# Altium schematic sheet voltage_sensor_HiZ_LV_OpAmp.SchDoc
size A4
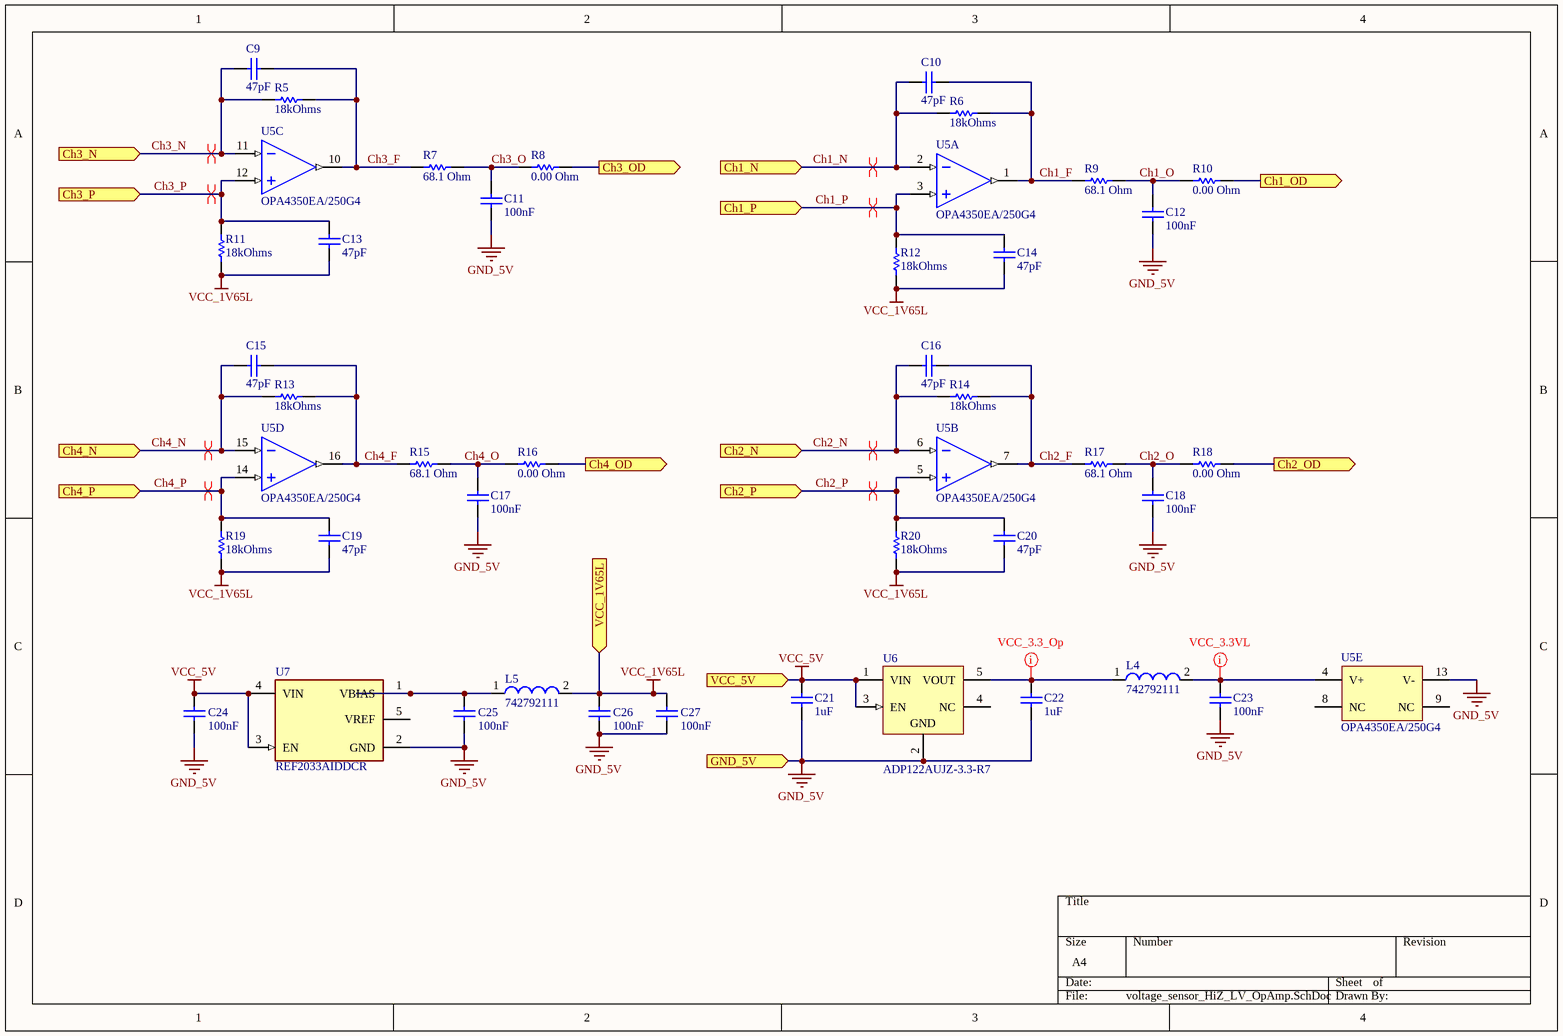
[diagram p0: voltage_sensor_HiZ_LV_OpAmp.SchDoc]

## Parts
C9  value 47pF  [CAPC0603(1608)100_L]  (hidden comment: CAP 47pF 50V 0603(1608))
C10  value 47pF  [CAPC0603(1608)100_L]  (hidden comment: CAP 47pF 50V 0603(1608))
C11  value 100nF  [CAPC0603(1608)100_L]  (hidden comment: CAP 100nF 10V 0603(1608))
C12  value 100nF  [CAPC0603(1608)100_L]  (hidden comment: CAP 100nF 10V 0603(1608))
C13  value 47pF  [CAPC0603(1608)100_L]  (hidden comment: CAP 47pF 50V 0603(1608))
C14  value 47pF  [CAPC0603(1608)100_L]  (hidden comment: CAP 47pF 50V 0603(1608))
C15  value 47pF  [CAPC0603(1608)100_L]  (hidden comment: CAP 47pF 50V 0603(1608))
C16  value 47pF  [CAPC0603(1608)100_L]  (hidden comment: CAP 47pF 50V 0603(1608))
C17  value 100nF  [CAPC0603(1608)100_L]  (hidden comment: CAP 100nF 10V 0603(1608))
C18  value 100nF  [CAPC0603(1608)100_L]  (hidden comment: CAP 100nF 10V 0603(1608))
C19  value 47pF  [CAPC0603(1608)100_L]  (hidden comment: CAP 47pF 50V 0603(1608))
C20  value 47pF  [CAPC0603(1608)100_L]  (hidden comment: CAP 47pF 50V 0603(1608))
C21  value 1uF  [CAPC0603(1608)100_N]  (hidden comment: CAP 1uF 50V 0603(1608))
C22  value 1uF  [CAPC0603(1608)100_N]  (hidden comment: CAP 1uF 50V 0603(1608))
C23  value 100nF  [CAPC0603(1608)100_L]  (hidden comment: CAP 100nF 10V 0603(1608))
C24  value 100nF  [CAPC0603(1608)100_N]  (hidden comment: CAP 100nF 10V 0603(1608))
C25  value 100nF  [CAPC0603(1608)100_N]  (hidden comment: CAP 100nF 10V 0603(1608))
C26  value 100nF  [CAPC0603(1608)100_L]  (hidden comment: CAP 100nF 10V 0603(1608))
C27  value 100nF  [CAPC0603(1608)100_L]  (hidden comment: CAP 100nF 10V 0603(1608))
L4  742792111  [SMD-1206]
L5  742792111  [SMD-1206]
R5  Resistance: 18kOhms  [RESC1608X55X25LL10T15]  (hidden comment: RC0603FR-0718KL)
R6  Resistance: 18kOhms  [RESC1608X55X25LL10T15]  (hidden comment: RC0603FR-0718KL)
R7  value 68.1 Ohm  [RESC1608X55X30LL15T15]  (hidden comment: ERJ-3EKF68R1V)
R8  value 0.00 Ohm  [RESC0603(1608)_L]  (hidden comment: Jumper 0603(1608))
R9  value 68.1 Ohm  [RESC1608X55X30LL15T15]  (hidden comment: ERJ-3EKF68R1V)
R10  value 0.00 Ohm  [RESC0603(1608)_L]  (hidden comment: Jumper 0603(1608))
R11  Resistance: 18kOhms  [RESC1608X55X25LL10T15]  (hidden comment: RC0603FR-0718KL)
R12  Resistance: 18kOhms  [RESC1608X55X25LL10T15]  (hidden comment: RC0603FR-0718KL)
R13  Resistance: 18kOhms  [RESC1608X55X25LL10T15]  (hidden comment: RC0603FR-0718KL)
R14  Resistance: 18kOhms  [RESC1608X55X25LL10T15]  (hidden comment: RC0603FR-0718KL)
R15  value 68.1 Ohm  [RESC1608X55X30LL15T15]  (hidden comment: ERJ-3EKF68R1V)
R16  value 0.00 Ohm  [RESC0603(1608)_L]  (hidden comment: Jumper 0603(1608))
R17  value 68.1 Ohm  [RESC1608X55X30LL15T15]  (hidden comment: ERJ-3EKF68R1V)
R18  value 0.00 Ohm  [RESC0603(1608)_L]  (hidden comment: Jumper 0603(1608))
R19  Resistance: 18kOhms  [RESC1608X55X25LL10T15]  (hidden comment: RC0603FR-0718KL)
R20  Resistance: 18kOhms  [RESC1608X55X25LL10T15]  (hidden comment: RC0603FR-0718KL)
U5  OPA4350EA/250G4  [TI-DBQ16_L]  (parts A,B,C,D,E of 5)
U6  ADP122AUJZ-3.3-R7  [ADI-UJ-5_N]
U7  REF2033AIDDCR  [FP-DDC0005A-IPC_C]

## Ports
Ch1_N (in), Ch1_OD (out), Ch1_P (in), Ch2_N (in), Ch2_OD (out), Ch2_P (in), Ch3_N (in), Ch3_OD (out), Ch3_P (in), Ch4_N (in), Ch4_OD (out), Ch4_P (in), GND_5V (in), VCC_1V65L (in), VCC_5V (in)

## Nets
GND_5V: C11.1 C12.1 C17.1 C18.1 C21.1 C22.1 C23.1 C24.1 C25.1 C26.1 C27.1 U5.13(V-) U6.2(GND) U7.2(GND) ; port GND_5V
VCC_1V65L: C13.2 C14.2 C19.2 C20.2 C26.2 C27.2 L5.2 R11.2 R12.2 R19.2 R20.2 ; port VCC_1V65L
VCC_5V: C21.2 C24.2 U6.1(VIN) U6.3(EN) U7.3(EN) U7.4(VIN) ; port VCC_5V
Ch1_F: C10.2 R6.1 R9.2 U5.1(OUT_A)
Ch1_N: C10.1 R6.2 U5.2(IN_A-) ; port Ch1_N
Ch1_O: C12.2 R9.1 R10.2
Ch1_OD: R10.1 ; port Ch1_OD
Ch1_P: C14.1 R12.1 U5.3(IN_A+) ; port Ch1_P
Ch2_F: C16.2 R14.1 R17.2 U5.7(OUT_B)
Ch2_N: C16.1 R14.2 U5.6(IN_B-) ; port Ch2_N
Ch2_O: C18.2 R17.1 R18.2
Ch2_OD: R18.1 ; port Ch2_OD
Ch2_P: C20.1 R20.1 U5.5(IN_B+) ; port Ch2_P
Ch3_F: C9.2 R5.1 R7.2 U5.10(OUT_C)
Ch3_N: C9.1 R5.2 U5.11(IN_C-) ; port Ch3_N
Ch3_O: C11.2 R7.1 R8.2
Ch3_OD: R8.1 ; port Ch3_OD
Ch3_P: C13.1 R11.1 U5.12(IN_C+) ; port Ch3_P
Ch4_F: C15.2 R13.1 R15.2 U5.16(OUT_D)
Ch4_N: C15.1 R13.2 U5.15(IN_D-) ; port Ch4_N
Ch4_O: C17.2 R15.1 R16.2
Ch4_OD: R16.1 ; port Ch4_OD
Ch4_P: C19.1 R19.1 U5.14(IN_D+) ; port Ch4_P
NetC22_2: C22.2 L4.1 U6.5(VOUT)
NetC23_2: C23.2 L4.2 U5.4(V+)
NetC25_2: C25.2 L5.1 U7.1(VBIAS)

Not connected (* = marked no-connect by the designer): U5 8(NC) 9(NC); U6 4(NC); U7 5(VREF)

## Layout directives
differential pair: Ch1_N, Ch1_P, Ch2_N, Ch2_P, Ch3_N, Ch3_P, Ch4_N, Ch4_P
mark named VCC_3.3_Op: NetC22_2
mark named VCC_3.3VL: NetC23_2

## Library data of the parts
C9 C10 C13-C16 C19 C20 = CMP-1035-01063-1: CAP 47pF 50V ±5% 0603 (1608 Metric) Thickness 1mm SMD; Case-EIA: 0603; Tolerance: Â±5%; Case-Metric: 1608; Technology: SMT; Max Thickness: 1 mm; Rated Voltage: 50 V
C11 C12 C17 C18 C23-C27 = CMP-1035-02580-1: CAP 100nF 10V ±10% 0603 (1608 Metric) Thickness 1mm SMD; Tolerance: Â±10%; Case-EIA: 0603; Case-Metric: 1608; Max Thickness: 1 mm; Rated Voltage: 10 V; Technology: SMT
C21 C22 = CMP-1035-02746-1: CAP 1uF 50V ±20% 0603 (1608 Metric) Thickness 1mm SMD; Tolerance: Â±20%; Case-EIA: 0603; Case-Metric: 1608; Technology: SMT; Max Thickness: 1 mm; Rated Voltage: 50 V
L4 L5 = CMP-0220-00024-1: SMD EMI Suppression Ferrite Bead WE-CBF, Z = 26 Ohm; Impedance: 26 Ohm; ComponentLink2Description: Datasheet; PackageReference: SMD-1206; ComponentLink2URL: http://www.we-online.de/katalog/media/pdf/742792111.pdf; PackageVersion: 2007; DatasheetVersion: Dec-2005; PackageDescription: Chip Inductor, 2-Leads, Body 3.2 x 1.6 mm; ComponentLink1URL: http://www.we-online.com; ComponentLink1Description: Manufacturer Link
R5 R6 R11-R14 R19 R20 = CMP-2000-06930-1: Chip Resistor, 18 KOhm, +/- 1%, 0.1 W, -55 to 155 degC, 0603 (1608 Metric), RoHS, Tape and Reel; Manufacturer: Yageo; Voltage Rating: 75V; Temperature Coefficient: 100PPM/C; Unit Weight: 0.000071oz; Power Rating: 100mW; Datasheet URL: http://www.yageo.com/documents/recent/PYu-RC_Group_51_RoHS_L_7.pdf; Packaging: Reel; Series: RC; Datasheet Version: Rev. 7, 05/2017; Type: GeneralPurposeChipResistorSurfaceMount; Termination Style: SMD/SMT; Package Reference: 0603; Operating Temperature Range: -55Cto+155C; Mounting Technology: SurfaceMount; Tolerance: 1%; Height: 0.45mm; Length: 1.6mm; Case Code - mm: 1608; Product: ThickFilmResistorsGeneralPurpose; RoHS: True; Product Category: ThickFilmResistors; Case Code - in: 0603; Brand: Yageo; Manufacturer URL: http://www.yageo.com/; Width: 0.8mm; Package / Case: 0603(1608metric); Package Description: 2-Pin Surface Mount Device, Body 1.6 x 0.8 mm
R7 R9 R15 R17 = CMP-2000-00621-1: Manufacturer: Panasonic; Tolerance: 1%; Part Number: ERJ-3EKF68R1V; Package: 0603
R8 R10 R16 R18 = CMP-1012-00001-1: Jumper 0603 (1608 Metric); Case-Metric: 1608; Power: None; Case-EIA: 0603; Technology: SMT; Tolerance: None
U5 = CMP-0272-00834-2: High-Speed, Single-Supply, Rail-to-Rail Operational Amplifier MicroAmplifier(TM) Series, 2.7 to 5.5 V, -55 to 150 degC, 16-pin SOP (DBQ16), Green (RoHS & no Sb/Br); Manufacturer: Texas Instruments; Iq per channel(Max)(mA): 7.5; Slew Rate(Typ)(V/us): 22; Sub Family: Low Input Bias Current Amp (<=10pA), Low Offset Voltage Amplifier (<=500uV), Low Supply Voltage Amplifier (<=2.7V), Precision Amplifier; Vn at 1kHz(Typ)(nV/rtHz): 18; CMRR(Min)(dB): 66; Offset Drift(Typ)(uV/C): 4; Vio (25C)(Max)(mV): 0.5; Total Supply Voltage(Min)(+5V is 5, +/-5V is 10): 2.7; IIB(Max)(pA): 10; Total Supply Voltage(Max)(+5V is 5, +/-5V is 10): 5.5; Eco-Plan: Green (RoHS & no Sb/Br); PackageVersion: 4073301-2/H, 10/2008; ComponentLink1Description: Manufacturer URL; ComponentLink2Description: Datasheet; Mounting Technology: Surface Mount; ComponentLink3Description: Package Specification; PackageReference: DBQ16; PartNumber: OPA4350EA/250G4; ComponentLink2URL: http://www.ti.com/general/docs/lit/getliterature.tsp?genericPartNumber=OPA4350&fileType=pdf; ComponentLink1URL: http://www.ti.com/; Code_JEDEC: MO-137; DatasheetVersion: SBOS099C; Number of Channels: 4; ComponentLink3URL: http://www.ti.com/litv/pdf/msoi004g; PackageDescription: 16-Pin, Plastic Small Outline, Body 3.9 x 4.9 mm, Pitch 0.635 mm
U6 = CMP-0786-00346-1: 300 mA, Low Quiescent Current, CMOS Linear Regulator, 2.3 to 5.5 V Vin, 3.3 V Vout, Industrial, 5-pin SOT23 (UJ-5), Reel; Manufacturer: Analog Devices; Vin (min) (V): 2.3; Supply Current IGND @ Small Load: 45uA; Vin (max) (V): 5.5; Iout max: 300mA; Preset Vout Values (V): 3.3; ComponentLink4Description: URL Link1; ComponentLink4URL: Product URL:http://www.analog.com/en/ADP122/productSearch.html; ComponentLink2URL: http://www.analog.com/static/imported-files/data_sheets/ADP122_123.pdf; PackageDescription: 5-Pin Thin Small Outline Transistor Package, Body 2.9 x 1.6 mm, Pitch 0.95 mm; ComponentLink1URL: http://www.analog.com/en/index.html; ComponentLink3URL: http:/www.analog.com/static/imported-files/packages/PKG_PDF/TSOT(UJ)/UJ_5.pdf; ComponentLink2Description: Datasheet; PartNumber: ADP122AUJZ-3.3-R7; Packing: Reel; ComponentLink1Description: Manufacturer URL; Code_JEDEC: MO-193-AB; PackageVersion: 100708-A, 10/2008; PackageReference: UJ-5; Mounting Technology: Surface Mount; DatasheetVersion: Rev. E; ComponentLink3Description: Package Specification
U7 = CMP-04916-000008-1: IC VREF SERIES 1.65V/3.3V 5SOT; Manufacturer: Texas Instruments; Standoff Height: 0mm; Nominal Supply Current: 360uA; Min Supply Voltage: 3.32V; Output Type: Fixed; Number Of Outputs: 2; Output Voltage: 1.65/3.3V; Output Current: 20mA; Max Supply Voltage: 5.5V; Max Junction Temp: +150°C; Automotive: No; Height: 1.1mm; Package: DDC0005A; Reference Type: Series; Manufacturer Part Number: REF2033AIDDCR; Temperature Range High: +125°C; Lead Free: Yes; ComponentLink2Description: Datasheet; Device Class L1: Integrated Circuits (ICs); Category: IC; RoHS: TRUE; Device Class L3: Voltage References; ComponentLink2URL: http://www.ti.com/lit/ds/symlink/ref2033.pdf; Device Class L2: Power Management ICs; Octopart: https://octopart.com/ref2033aiddcr-texas+instruments-46921199; Digikey Description: IC VREF SERIES 1.65V/3.3V 5SOT; Temperature: -40°C to +125°C; Temperature Range Low: -40°C